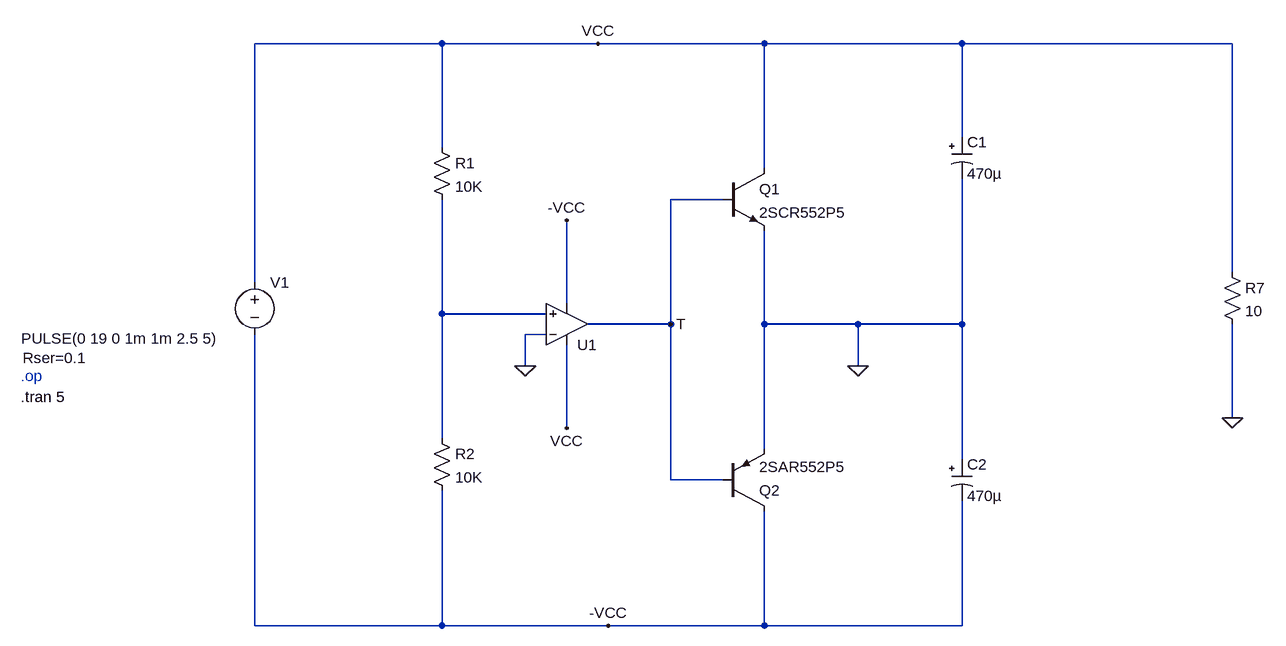
[diagram p0: schematic split_power_supply.asc]
split_power_supply.asc, the LTspice schematic file:
Version 4
SHEET 1 1144 680
WIRE -672 -304 -960 -304
WIRE -432 -304 -672 -304
WIRE -176 -304 -432 -304
WIRE 128 -304 -176 -304
WIRE 544 -304 128 -304
WIRE 128 -160 128 -304
WIRE -672 -144 -672 -304
WIRE -176 -112 -176 -304
WIRE -240 -64 -320 -64
WIRE 544 48 544 -304
WIRE -960 64 -960 -304
WIRE -480 96 -480 -32
WIRE -672 112 -672 -64
WIRE -512 112 -672 112
WIRE -320 128 -320 -64
WIRE -320 128 -448 128
WIRE -176 128 -176 -16
WIRE -32 128 -176 128
WIRE 128 128 128 -96
WIRE 128 128 -32 128
WIRE -512 144 -544 144
WIRE -544 192 -544 144
WIRE -32 192 -32 128
WIRE 544 272 544 128
WIRE -480 288 -480 160
WIRE -672 304 -672 112
WIRE -176 320 -176 128
WIRE 128 336 128 128
WIRE -320 368 -320 128
WIRE -240 368 -320 368
WIRE -960 592 -960 144
WIRE -672 592 -672 384
WIRE -672 592 -960 592
WIRE -416 592 -672 592
WIRE -176 592 -176 416
WIRE -176 592 -416 592
WIRE 128 592 128 400
WIRE 128 592 -176 592
FLAG -32 192 0
FLAG 544 272 0
FLAG -320 128 T
FLAG -544 192 0
FLAG -432 -304 VCC
FLAG -416 592 -VCC
FLAG -480 288 VCC
FLAG -480 -32 -VCC
SYMBOL voltage -960 48 R0
WINDOW 123 0 0 Left 0
WINDOW 39 -357 132 Left 2
WINDOW 3 -359 102 Left 2
SYMATTR SpiceLine Rser=0.1
SYMATTR InstName V1
SYMATTR Value PULSE(0 19 0 1m 1m 2.5 5)
SYMBOL res -688 -160 R0
SYMATTR InstName R1
SYMATTR Value 10K
SYMATTR SpiceLine tol=1 pwr=0.1
SYMBOL res -688 288 R0
SYMATTR InstName R2
SYMATTR Value 10K
SYMATTR SpiceLine tol=1 pwr=0.1
SYMBOL polcap 112 -160 R0
WINDOW 3 24 56 Left 2
SYMATTR Value 470µ
SYMATTR InstName C1
SYMATTR Description Capacitor
SYMATTR Type cap
SYMATTR SpiceLine V=50 Irms=222m Rser=0.8522 Lser=4.476n
SYMBOL OpAmps\\UniversalOpAmp2 -480 128 M180
SYMATTR InstName U1
SYMBOL npn -240 -112 R0
SYMATTR InstName Q1
SYMATTR Value 2SCR552P5
SYMBOL pnp -240 416 M180
SYMATTR InstName Q2
SYMATTR Value 2SAR552P5
SYMBOL res 528 32 R0
SYMATTR InstName R7
SYMATTR Value 10
SYMBOL polcap 112 336 R0
WINDOW 3 24 56 Left 2
SYMATTR Value 470µ
SYMATTR InstName C2
SYMATTR Description Capacitor
SYMATTR Type cap
SYMATTR SpiceLine V=50 Irms=222m Rser=0.8522 Lser=4.476n
TEXT -1320 208 Left 2 ;.op
TEXT -1320 240 Left 2 !.tran 5

The netlist it stands for:
* split_power_supply.asc
V1 VCC -VCC PULSE(0 19 0 1m 1m 2.5 5) Rser=0.1
R1 VCC N001 10K tol=1 pwr=0.1
R2 N001 -VCC 10K tol=1 pwr=0.1
C1 VCC 0 470µ V=50 Irms=222m Rser=0.8522 Lser=4.476n
XU1 N001 0 VCC -VCC T level2 Avol=1Meg GBW=10Meg Slew=10Meg Ilimit=25m Rail=0 Vos=0 En=0 Enk=0 In=0 Ink=0 Rin=500Meg  ; pins In+ In- V+ V- OUT
Q1 VCC T 0 0 2SCR552P5
Q2 -VCC T 0 0 2SAR552P5
R7 VCC 0 10
C2 0 -VCC 470µ V=50 Irms=222m Rser=0.8522 Lser=4.476n
.model NPN NPN
.model PNP PNP
.lib standard.bjt
* .op
.tran 5
.lib UniversalOpAmp2.lib
.backanno
.end

* Results of the author's LTspice run, read from the files saved beside the schematic
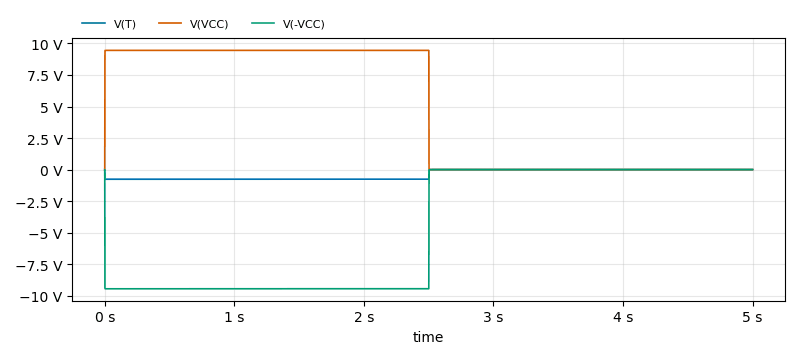
[diagram p1: Transient Analysis of split_power_supply.asc, plotted from the saved traces]
* Transient Analysis, 1 run:
*   V(T): min -765.9 mV, max 3.558 mV, average -383.3 mV, rms 541.7 mV, last -2.129 mV
*   V(VCC): min -7.863 mV, max 9.453 V, average 4.728 V, rms 6.685 V, last 0 V
*   V(-VCC): min -9.453 V, max 1.378 µV, average -4.728 V, rms 6.685 V, last 1.378 µV